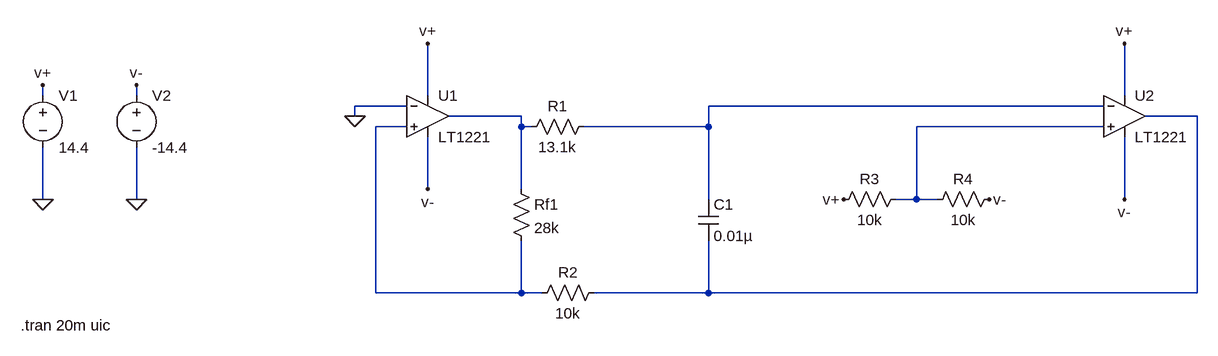
[diagram p0: schematic posible_circuito_gernerador.asc]
posible_circuito_gernerador.asc, the LTspice schematic file:
Version 4
SHEET 1 880 680
WIRE -944 48 -944 32
WIRE -800 48 -800 32
WIRE -352 48 -352 -32
WIRE 720 48 720 -32
WIRE -384 64 -464 64
WIRE 688 64 80 64
WIRE -464 80 -464 64
WIRE -208 80 -320 80
WIRE 832 80 752 80
WIRE -384 96 -432 96
WIRE -208 96 -208 80
WIRE -192 96 -208 96
WIRE 80 96 80 64
WIRE 80 96 -112 96
WIRE 688 96 400 96
WIRE -352 192 -352 112
WIRE -208 192 -208 96
WIRE -944 208 -944 128
WIRE -800 208 -800 128
WIRE 80 208 80 96
WIRE 400 208 400 96
WIRE 400 208 368 208
WIRE 432 208 400 208
WIRE 720 208 720 112
WIRE -432 352 -432 96
WIRE -208 352 -208 272
WIRE -208 352 -432 352
WIRE -176 352 -208 352
WIRE 80 352 80 272
WIRE 80 352 -96 352
WIRE 832 352 832 80
WIRE 832 352 80 352
FLAG -352 -32 v+
FLAG 720 -32 v+
FLAG -352 192 v-
FLAG 720 208 v-
FLAG -464 80 0
FLAG 288 208 v+
FLAG 512 208 v-
FLAG -944 208 0
FLAG -800 208 0
FLAG -944 32 v+
FLAG -800 32 v-
SYMBOL res -224 176 R0
SYMATTR InstName Rf1
SYMATTR Value 28k
SYMBOL res -96 80 R90
WINDOW 0 0 56 VBottom 2
WINDOW 3 32 56 VTop 2
SYMATTR InstName R1
SYMATTR Value 13.1k
SYMBOL res -80 336 R90
WINDOW 0 0 56 VBottom 2
WINDOW 3 32 56 VTop 2
SYMATTR InstName R2
SYMATTR Value 10k
SYMBOL cap 64 208 R0
SYMATTR InstName C1
SYMATTR Value 0.01µ
SYMBOL Opamps\\LT1221 -352 16 R0
SYMATTR InstName U1
SYMBOL Opamps\\LT1221 720 16 R0
SYMATTR InstName U2
SYMBOL res 384 192 R90
WINDOW 0 0 56 VBottom 2
WINDOW 3 32 56 VTop 2
SYMATTR InstName R3
SYMATTR Value 10k
SYMBOL res 528 192 R90
WINDOW 0 0 56 VBottom 2
WINDOW 3 32 56 VTop 2
SYMATTR InstName R4
SYMATTR Value 10k
SYMBOL voltage -944 32 R0
WINDOW 123 0 0 Left 0
WINDOW 39 0 0 Left 0
SYMATTR InstName V1
SYMATTR Value 14.4
SYMBOL voltage -800 32 R0
WINDOW 123 0 0 Left 0
WINDOW 39 0 0 Left 0
SYMATTR InstName V2
SYMATTR Value -14.4
TEXT -978 402 Left 2 !.tran 20m uic

The netlist it stands for:
* posible_circuito_gernerador.asc
Rf1 N002 N004 28k
R1 N001 N002 13.1k
R2 N003 N004 10k
C1 N001 N003 0.01µ
XU1 N004 0 v+ v- N002 LT1221  ; pins In+ In- V+ V- OUT
XU2 N005 N001 v+ v- N003 LT1221  ; pins In+ In- V+ V- OUT
R3 N005 v+ 10k
R4 v- N005 10k
V1 v+ 0 14.4
V2 v- 0 -14.4
.tran 20m uic
.backanno
.end